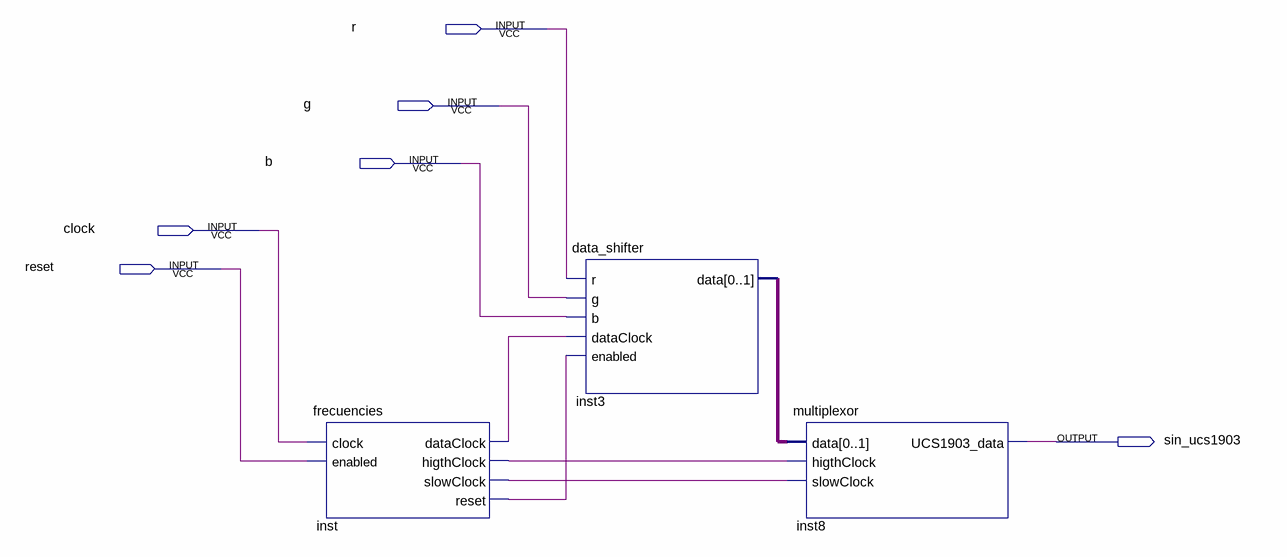
[diagram p0: schematic sheet]
// Quartus schematic ucs1903.bdf as structural Verilog: 3 symbols, 6 pins
module ucs1903 (
  input  r,
  input  g,
  input  b,
  input  clock,
  input  reset,
  output sin_ucs1903
);

  wire inst_dataclock, inst_higthclock, inst_reset, inst_slowclock;
  wire [1:0] inst3_data;

  frecuencies inst (
    .clock(clock), .enabled(reset), .dataClock(inst_dataclock), .higthClock(inst_higthclock),
    .slowClock(inst_slowclock), .reset(inst_reset));
  data_shifter inst3 (.r(r), .g(g), .b(b), .dataClock(inst_dataclock), .enabled(inst_reset), .data(inst3_data));
  multiplexor inst8 (
    .data(inst3_data), .higthClock(inst_higthclock), .slowClock(inst_slowclock), .UCS1903_data(sin_ucs1903));
endmodule
